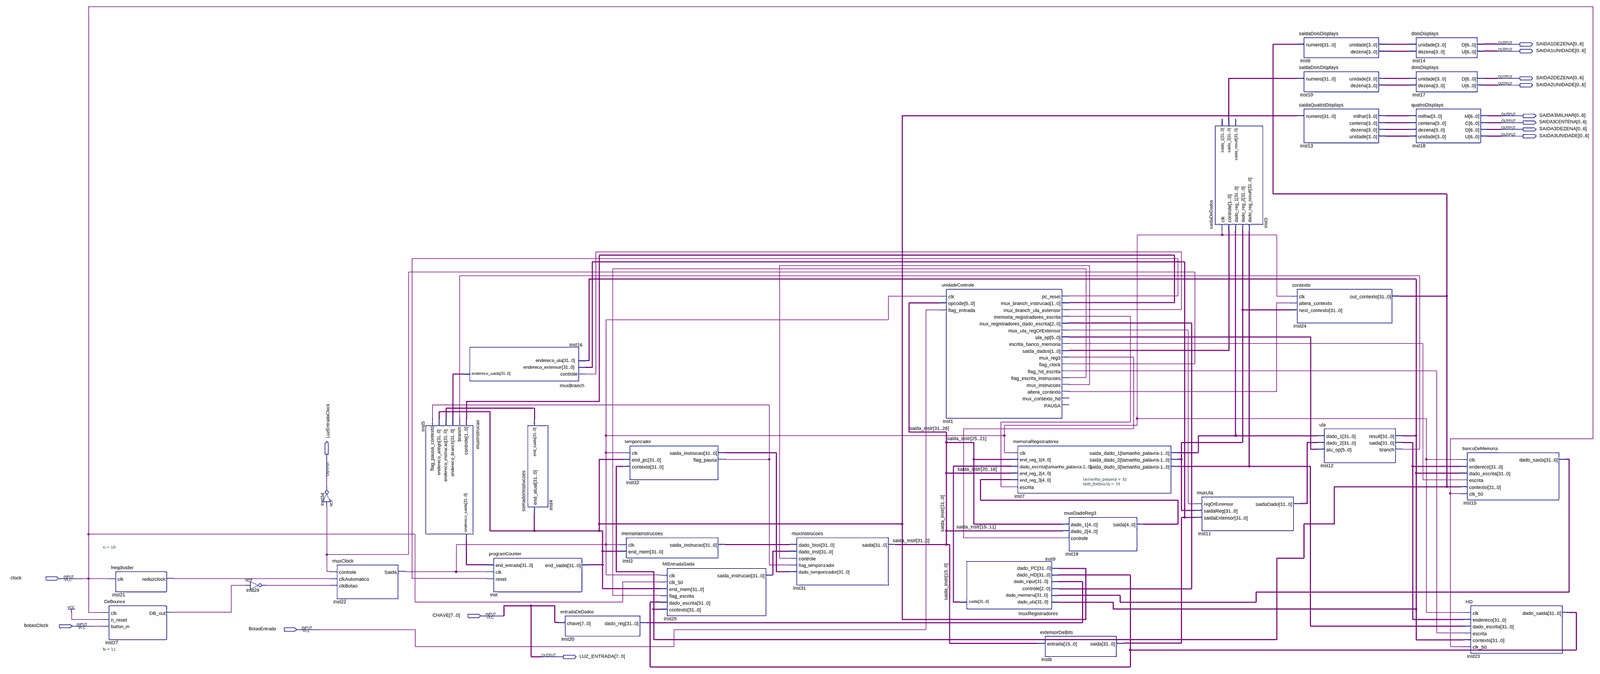
[diagram p0: schematic sheet, whole]
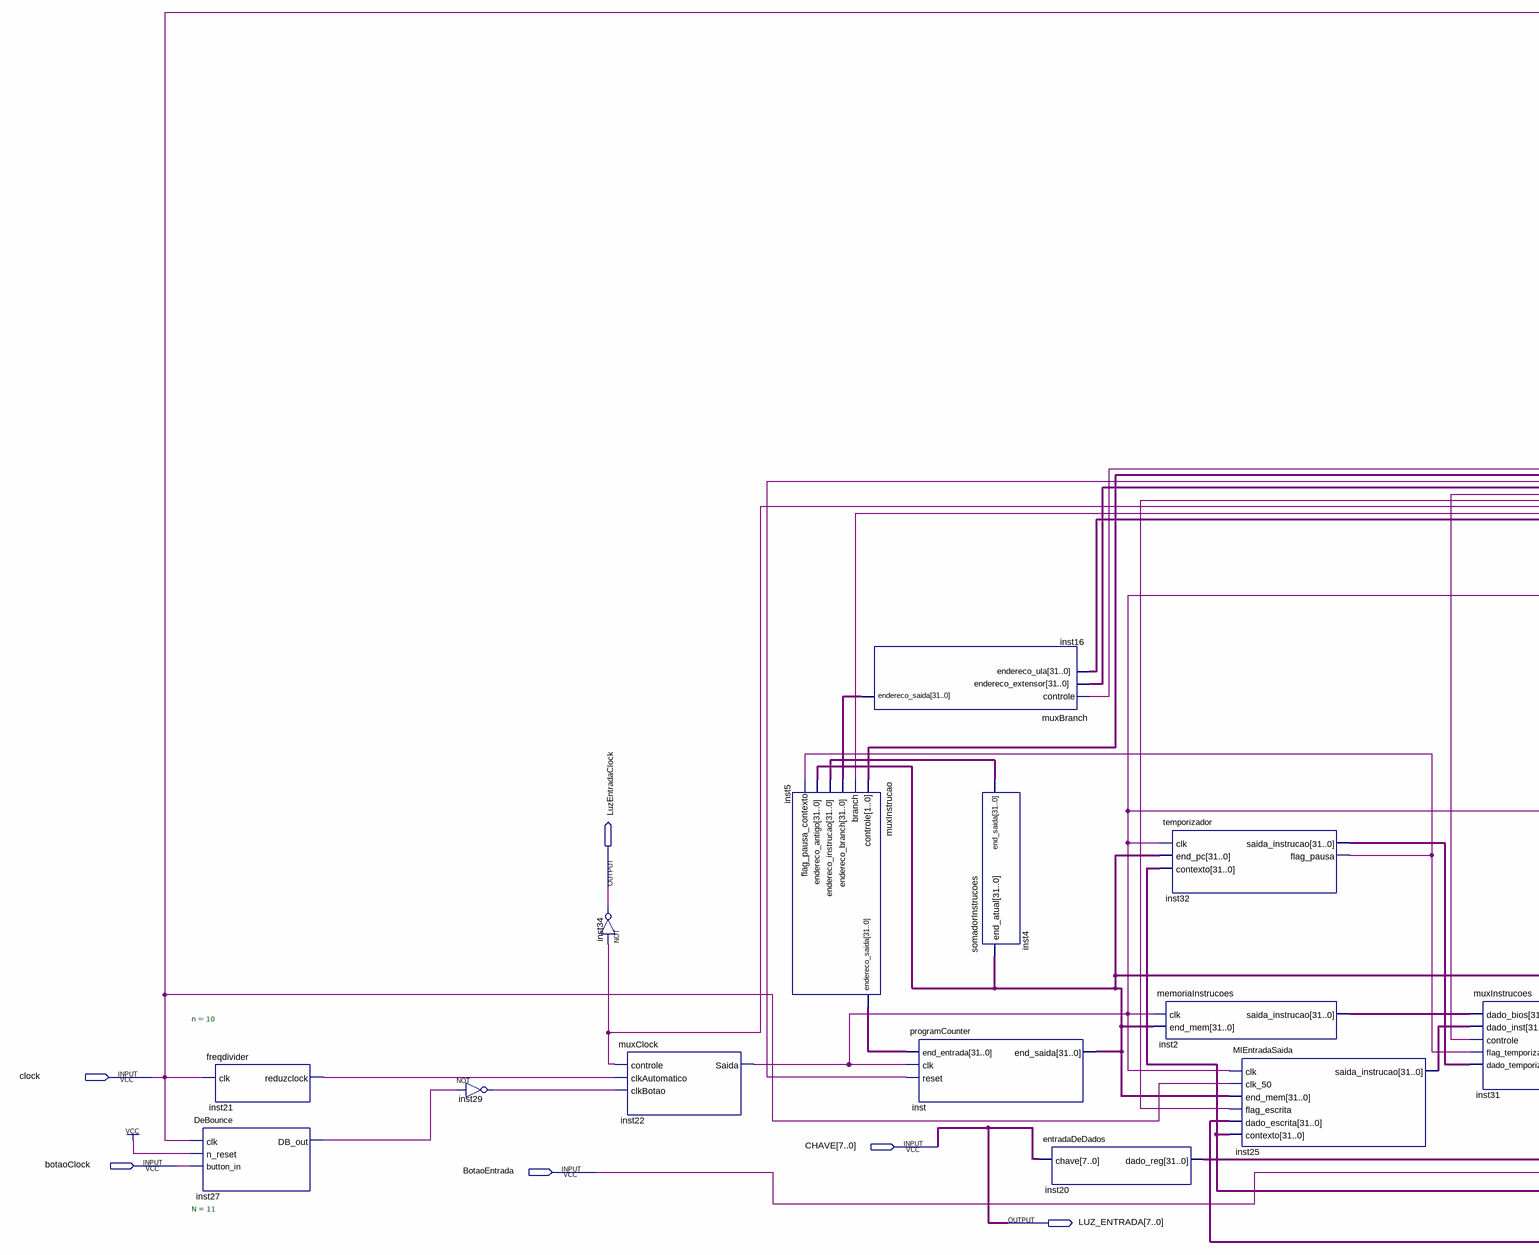
[diagram p1: schematic sheet, left part]
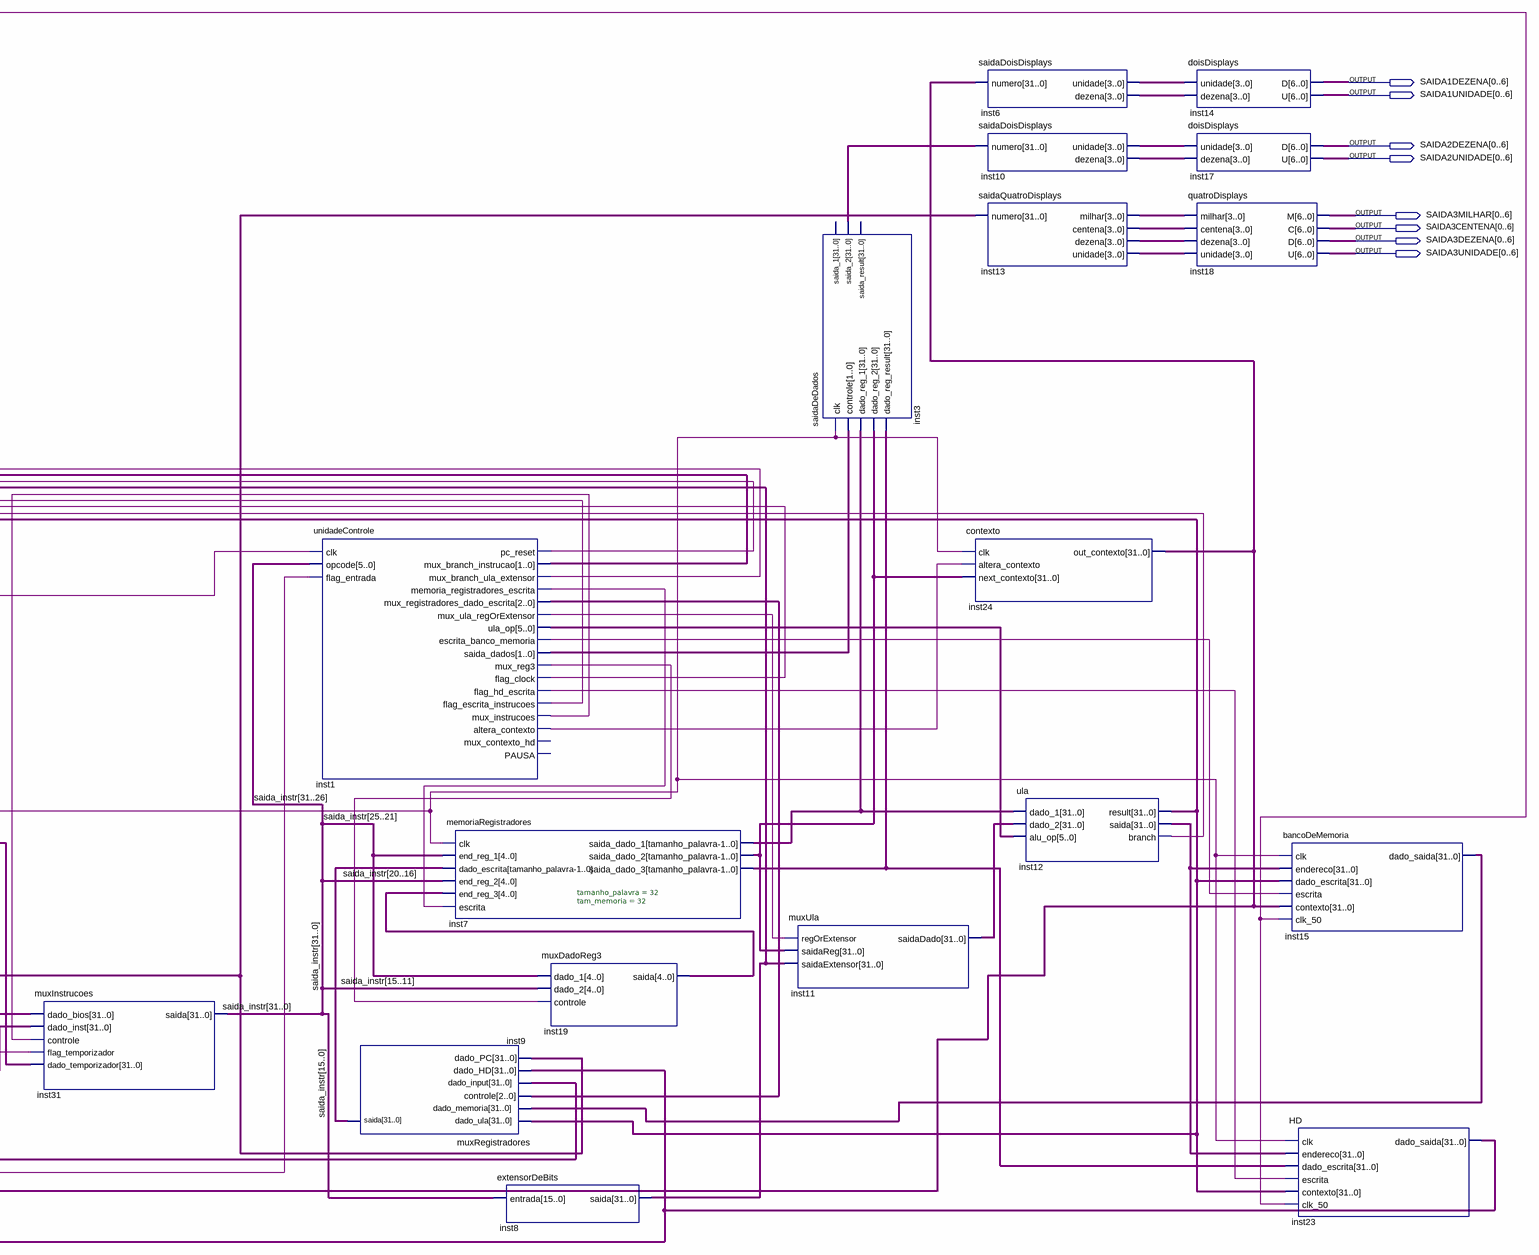
[diagram p2: schematic sheet, right part]
// Quartus schematic projaoc.bdf as structural Verilog: 31 symbols, 14 pins
module projaoc (
  input  clock,
  input  [7:0] CHAVE,
  input  botaoClock,
  input  BotaoEntrada,
  output [0:6] SAIDA1DEZENA,
  output [0:6] SAIDA1UNIDADE,
  output [0:6] SAIDA2DEZENA,
  output [0:6] SAIDA2UNIDADE,
  output [0:6] SAIDA3MILHAR,
  output [0:6] SAIDA3CENTENA,
  output [0:6] SAIDA3DEZENA,
  output [0:6] SAIDA3UNIDADE,
  output LuzEntradaClock,
  output [7:0] LUZ_ENTRADA
);

  wire inst1_altera_contexto, inst1_escrita_banco_memoria, inst1_flag_clock, inst1_flag_escrita_instrucoes,
       inst1_flag_hd_escrita, inst1_memoria_registradores_escrita, inst1_mux_branch_ula_extensor,
       inst1_mux_instrucoes, inst1_mux_reg3, inst1_mux_ula_regorextensor, inst1_pc_reset, inst12_branch,
       inst21_reduzclock, inst22_saida, inst27_db_out, inst29_out, inst32_flag_pausa;
  wire [1:0] inst1_mux_branch_instrucao, inst1_saida_dados;
  wire [2:0] inst1_mux_registradores_dado_escrita;
  wire [3:0] inst6_dezena, inst6_unidade, inst10_dezena, inst10_unidade, inst13_centena, inst13_dezena,
       inst13_milhar, inst13_unidade;
  wire [4:0] inst19_saida;
  wire [5:0] inst1_ula_op;
  wire [31:0] inst2_saida_instrucao, inst3_saida_2, inst4_end_saida, inst5_endereco_saida,
       inst7_saida_dado_1, inst7_saida_dado_2, inst7_saida_dado_3, inst8_saida, inst9_saida,
       inst11_saidadado, inst12_result, inst12_saida, inst15_dado_saida, inst16_endereco_saida,
       inst20_dado_reg, inst23_dado_saida, inst24_out_contexto, inst25_saida_instrucao,
       inst32_saida_instrucao, inst_end_saida, saida_instr;

  freqdivider #(.n(10)) inst21 (.clk(clock), .reduzclock(inst21_reduzclock));
  DeBounce #(.N(11)) inst27 (.clk(clock), .n_reset(1'b1), .button_in(botaoClock), .DB_out(inst27_db_out));
  not inst29 (inst29_out, inst27_db_out);
  not inst34 (LuzEntradaClock, inst1_flag_clock);
  muxClock inst22 (
    .controle(inst1_flag_clock), .clkAutomatico(inst21_reduzclock), .clkBotao(inst29_out),
    .Saida(inst22_saida));
  muxInstrucao inst5 (
    .controle(inst1_mux_branch_instrucao), .branch(inst12_branch), .endereco_branch(inst16_endereco_saida),
    .endereco_instrucao(inst4_end_saida), .endereco_antigo(inst_end_saida),
    .flag_pausa_contexto(inst32_flag_pausa), .endereco_saida(inst5_endereco_saida));
  muxBranch inst16 (
    .controle(inst1_mux_branch_ula_extensor), .endereco_extensor(inst8_saida), .endereco_ula(inst12_result),
    .endereco_saida(inst16_endereco_saida));
  programCounter inst (
    .end_entrada(inst5_endereco_saida), .clk(inst22_saida), .reset(inst1_pc_reset), .end_saida(inst_end_saida));
  somadorInstrucoes inst4 (.end_atual(inst_end_saida), .end_saida(inst4_end_saida));
  entradaDeDados inst20 (.chave(CHAVE), .dado_reg(inst20_dado_reg));
  temporizador inst32 (
    .clk(inst22_saida), .end_pc(inst_end_saida), .contexto(inst24_out_contexto),
    .saida_instrucao(inst32_saida_instrucao), .flag_pausa(inst32_flag_pausa));
  memoriaInstrucoes inst2 (.clk(inst22_saida), .end_mem(inst_end_saida), .saida_instrucao(inst2_saida_instrucao));
  MIEntradaSaida inst25 (
    .clk(inst22_saida), .clk_50(clock), .end_mem(inst_end_saida),
    .flag_escrita(inst1_flag_escrita_instrucoes), .dado_escrita(inst23_dado_saida),
    .contexto(inst24_out_contexto), .saida_instrucao(inst25_saida_instrucao));
  muxInstrucoes inst31 (
    .dado_bios(inst2_saida_instrucao), .dado_inst(inst25_saida_instrucao), .controle(inst1_mux_instrucoes),
    .flag_temporizador(inst32_flag_pausa), .dado_temporizador(inst32_saida_instrucao), .saida(saida_instr));
  unidadeControle inst1 (
    .clk(inst22_saida), .opcode(saida_instr[31:26]), .flag_entrada(BotaoEntrada), .pc_reset(inst1_pc_reset),
    .mux_branch_instrucao(inst1_mux_branch_instrucao),
    .mux_branch_ula_extensor(inst1_mux_branch_ula_extensor),
    .memoria_registradores_escrita(inst1_memoria_registradores_escrita),
    .mux_registradores_dado_escrita(inst1_mux_registradores_dado_escrita),
    .mux_ula_regOrExtensor(inst1_mux_ula_regorextensor), .ula_op(inst1_ula_op),
    .escrita_banco_memoria(inst1_escrita_banco_memoria), .saida_dados(inst1_saida_dados),
    .mux_reg3(inst1_mux_reg3), .flag_clock(inst1_flag_clock), .flag_hd_escrita(inst1_flag_hd_escrita),
    .flag_escrita_instrucoes(inst1_flag_escrita_instrucoes), .mux_instrucoes(inst1_mux_instrucoes),
    .altera_contexto(inst1_altera_contexto));  // open: mux_contexto_hd, PAUSA
  muxRegistradores inst9 (
    .dado_ula(inst12_result), .dado_memoria(inst15_dado_saida),
    .controle(inst1_mux_registradores_dado_escrita), .dado_input(inst20_dado_reg),
    .dado_HD(inst23_dado_saida), .dado_PC(inst_end_saida), .saida(inst9_saida));
  memoriaRegistradores #(.tamanho_palavra(32), .tam_memoria(32)) inst7 (
    .clk(inst22_saida), .end_reg_1(saida_instr[25:21]), .dado_escrita(inst9_saida),
    .end_reg_2(saida_instr[20:16]), .end_reg_3(inst19_saida), .escrita(inst1_memoria_registradores_escrita),
    .saida_dado_1(inst7_saida_dado_1), .saida_dado_2(inst7_saida_dado_2), .saida_dado_3(inst7_saida_dado_3));
  muxDadoReg3 inst19 (
    .dado_1(saida_instr[25:21]), .dado_2(saida_instr[15:11]), .controle(inst1_mux_reg3), .saida(inst19_saida));
  extensorDeBits inst8 (.entrada(saida_instr[15:0]), .saida(inst8_saida));
  muxUla inst11 (
    .regOrExtensor(inst1_mux_ula_regorextensor), .saidaReg(inst7_saida_dado_2), .saidaExtensor(inst8_saida),
    .saidaDado(inst11_saidadado));
  saidaDeDados inst3 (
    .clk(inst22_saida), .controle(inst1_saida_dados), .dado_reg_1(inst7_saida_dado_1),
    .dado_reg_2(inst7_saida_dado_2), .dado_reg_result(inst7_saida_dado_3), .saida_2(inst3_saida_2));  // open: saida_1, saida_result
  saidaDoisDisplays inst6 (.numero(inst24_out_contexto), .unidade(inst6_unidade), .dezena(inst6_dezena));
  saidaDoisDisplays inst10 (.numero(inst3_saida_2), .unidade(inst10_unidade), .dezena(inst10_dezena));
  saidaQuatroDisplays inst13 (
    .numero(inst_end_saida), .milhar(inst13_milhar), .centena(inst13_centena), .dezena(inst13_dezena),
    .unidade(inst13_unidade));
  contexto inst24 (
    .clk(inst22_saida), .altera_contexto(inst1_altera_contexto), .next_contexto(inst7_saida_dado_2),
    .out_contexto(inst24_out_contexto));
  ula inst12 (
    .dado_1(inst7_saida_dado_1), .dado_2(inst11_saidadado), .alu_op(inst1_ula_op), .result(inst12_result),
    .saida(inst12_saida), .branch(inst12_branch));
  doisDisplays inst14 (.unidade(inst6_unidade), .dezena(inst6_dezena), .D(SAIDA1DEZENA), .U(SAIDA1UNIDADE));
  doisDisplays inst17 (.unidade(inst10_unidade), .dezena(inst10_dezena), .D(SAIDA2DEZENA), .U(SAIDA2UNIDADE));
  quatroDisplays inst18 (
    .milhar(inst13_milhar), .centena(inst13_centena), .dezena(inst13_dezena), .unidade(inst13_unidade),
    .M(SAIDA3MILHAR), .C(SAIDA3CENTENA), .D(SAIDA3DEZENA), .U(SAIDA3UNIDADE));
  bancoDeMemoria inst15 (
    .clk(inst22_saida), .endereco(inst12_saida), .dado_escrita(inst12_result),
    .escrita(inst1_escrita_banco_memoria), .contexto(inst24_out_contexto), .clk_50(clock),
    .dado_saida(inst15_dado_saida));
  HD inst23 (
    .clk(inst22_saida), .endereco(inst12_saida), .dado_escrita(inst7_saida_dado_3),
    .escrita(inst1_flag_hd_escrita), .contexto(inst12_result), .clk_50(clock), .dado_saida(inst23_dado_saida));

  assign LUZ_ENTRADA = CHAVE;
endmodule
